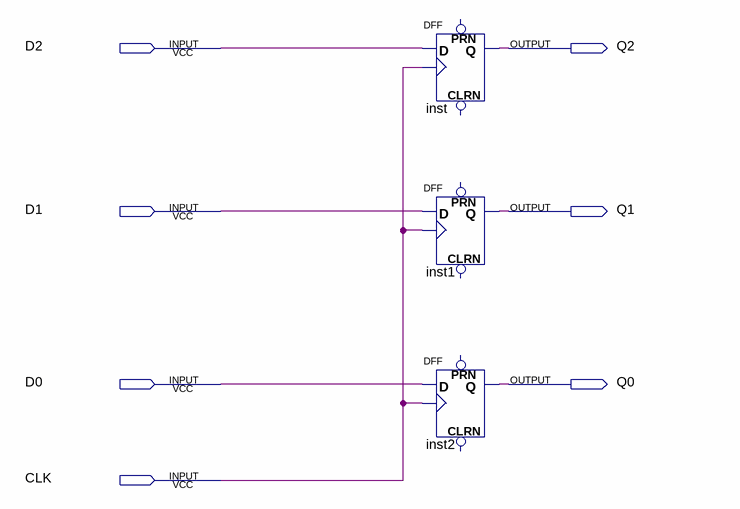
[diagram p0: schematic sheet]
// Quartus schematic MEF_estado.bdf as structural Verilog: 3 symbols, 7 pins
module MEF_estado (
  input  D2,
  input  D1,
  input  D0,
  input  CLK,
  output Q2,
  output Q1,
  output Q0
);

  DFF inst (.CLK(CLK), .D(D2), .Q(Q2));  // open: CLRN, PRN
  DFF inst1 (.CLK(CLK), .D(D1), .Q(Q1));  // open: CLRN, PRN
  DFF inst2 (.CLK(CLK), .D(D0), .Q(Q0));  // open: CLRN, PRN
endmodule
